# Altium schematic sheet Python_stm32f4_V1.0.0.SchDoc
size A3
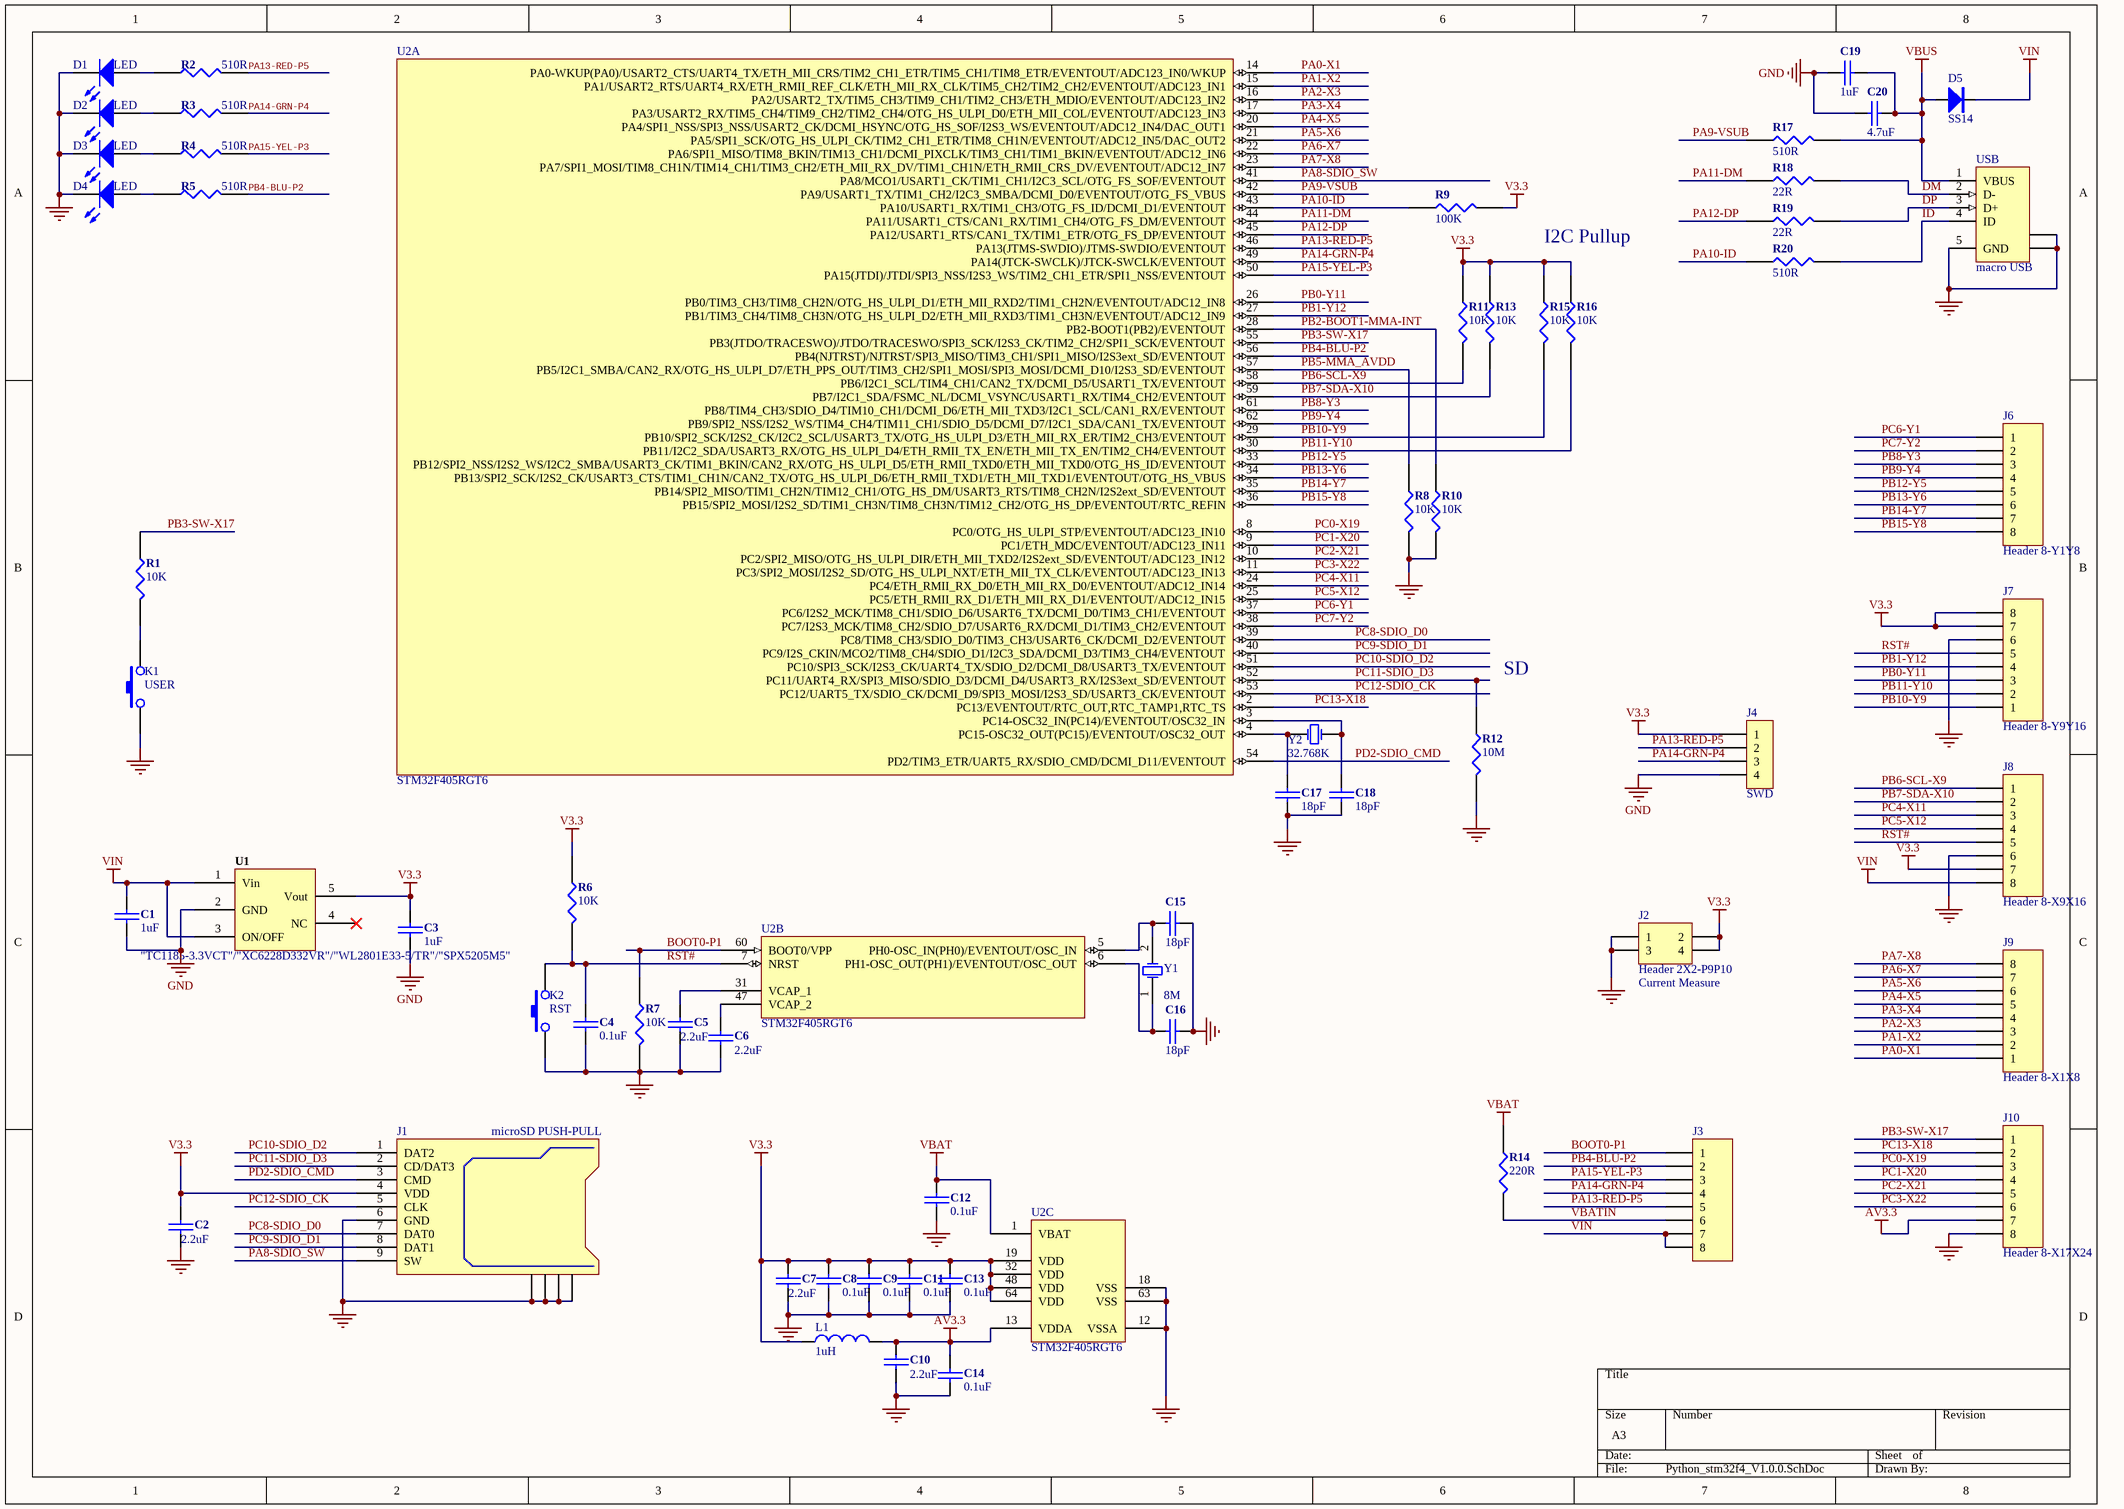
[diagram p0: Python_stm32f4_V1.0.0.SchDoc]

## Parts
C1  1uF  [C0402]
C2  2.2uF  [C0402]
C3  1uF  [C0402]
C4  0.1uF  [C0402]
C5  2.2uF  [C0402]
C6  2.2uF  [C0402]
C7  2.2uF  [C0402]
C8  0.1uF  [C0402]
C9  0.1uF  [C0402]
C10  2.2uF  [C0402]
C11  0.1uF  [C0402]
C12  0.1uF  [C0402]
C13  0.1uF  [C0402]
C14  0.1uF  [C0402]
C15  18pF  [C0402]
C16  18pF  [C0402]
C17  18pF  [C0402]
C18  18pF  [C0402]
C19  1uF  [C0402]
C20  4.7uF  [C0402]
D1  LED  [LED0603-green]
D2  LED  [LED0603-green]
D3  LED  [LED0603-green]
D4  LED  [LED0603-green]
D5  SS14  [Diode-0603]
J1  microSD PUSH-PULL  [MICROSD-1]
J2  Header 2X2-P9P10  [HDR2X2]
J3  (no value)  [HEADER-8]
J4  SWD  [HEADER-4]
J6  Header 8-Y1Y8  [HEADER-8]
J7  Header 8-Y9Y16  [HEADER-8]
J8  Header 8-X9X16  [HEADER-8]
J9  Header 8-X1X8  [HEADER-8]
J10  Header 8-X17X24  [HEADER-8]
K1  USER  [SW-4PIN-DIP]
K2  RST  [SW-4PIN-DIP]
L1  value 1uH  [C0402]  (hidden comment: Inductor)
R1  10K  [R0402 -1]
R2  510R  [R0402 -1]
R3  510R  [R0402 -1]
R4  510R  [R0402 -1]
R5  510R  [R0402 -1]
R6  10K  [R0402 -1]
R7  10K  [R0402 -1]
R8  10K  [R0402 -1]
R9  100K  [R0402 -1]
R10  10K  [R0402 -1]
R11  10K  [R0402 -1]
R12  10M  [R0402 -1]
R13  10K  [R0402 -1]
R14  220R  [R0402 -1]
R15  10K  [R0402 -1]
R16  10K  [R0402 -1]
R17  510R  [R0402 -1]
R18  22R  [R0402 -1]
R19  22R  [R0402 -1]
R20  510R  [R0402 -1]
U1  "TC1185-3.3VCT"/"XC6228D332VR"/"WL2801E33-5/TR"/"SPX5205M5"  [SOT-23-5]
U2  STM32F405RGT6  [LQFP-64]  (parts A,B,C of 3)
USB  macro USB  [MICRO_USB_9]
Y1  XTAL  [XTAL]  (value not drawn)
Y2  32.768K  [HDR1X2]

## Nets
AV3.3: C10.1 C14.2 J10.7 L1.2 U2.13(VDDA)
GND: C1.1 C2.2 C3.1 C4.1 C5.2 C6.2 C7.2 C8.1 C9.1 C10.2 C11.1 C12.1 C13.1 C14.1 C15.1 C16.1 C17.2 C18.2 C19.2 C20.2 D1.2(K) D2.2(K) D3.2(K) D4.2(K) J1.6(GND) J1.GP1 J1.GP2 J1.GP3 J1.GP4 J2.1 J2.3 J4.4 J7.6 J8.6 J10.8 K1.1 K2.1 R7.2 R8.2 R10.2 R12.2 U1.2(GND) U2.12(VSSA) U2.18(VSS) U2.63(VSS) USB.5(GND) USB.6(SHLD) USB.7(SHLD)
V3.3: C2.1 C3.2 C7.1 C8.2 C9.2 C11.2 C13.2 J1.4(VDD) J2.2 J2.4 J4.1 J7.7 J7.8 J8.7 L1.1 R6.1 R9.2 R11.1 R13.1 R15.1 R16.1 U1.5(Vout) U2.19(VDD) U2.32(VDD) U2.48(VDD) U2.64(VDD)
VBAT: C12.2 R14.1 U2.1(VBAT)
VBUS: C19.1 C20.1 D5.1 R17.2 USB.1(VBUS)
VIN: C1.2 D5.2 J3.7 J3.8 J8.8 U1.1(Vin) U1.3(ON/OFF)
BOOT0-P1: J3.1 R7.1 U2.60(BOOT0/VPP)
DM: R18.2 USB.2(D-)
DP: R19.2 USB.3(D+)
ID: R20.2 USB.4(ID)
PA0-X1: J9.1 U2.14(PA0-WKUP(PA0)/USART2_CTS/UART4_TX/ETH_MII_CRS/TIM2_CH1_ETR/TIM5_CH1/TIM8_ETR/EVENTOUT/ADC123_IN0/WKUP)
PA1-X2: J9.2 U2.15(PA1/USART2_RTS/UART4_RX/ETH_RMII_REF_CLK/ETH_MII_RX_CLK/TIM5_CH2/TIM2_CH2/EVENTOUT/ADC123_IN1)
PA2-X3: J9.3 U2.16(PA2/USART2_TX/TIM5_CH3/TIM9_CH1/TIM2_CH3/ETH_MDIO/EVENTOUT/ADC123_IN2)
PA3-X4: J9.4 U2.17(PA3/USART2_RX/TIM5_CH4/TIM9_CH2/TIM2_CH4/OTG_HS_ULPI_D0/ETH_MII_COL/EVENTOUT/ADC123_IN3)
PA4-X5: J9.5 U2.20(PA4/SPI1_NSS/SPI3_NSS/USART2_CK/DCMI_HSYNC/OTG_HS_SOF/I2S3_WS/EVENTOUT/ADC12_IN4/DAC_OUT1)
PA5-X6: J9.6 U2.21(PA5/SPI1_SCK/OTG_HS_ULPI_CK/TIM2_CH1_ETR/TIM8_CH1N/EVENTOUT/ADC12_IN5/DAC_OUT2)
PA6-X7: J9.7 U2.22(PA6/SPI1_MISO/TIM8_BKIN/TIM13_CH1/DCMI_PIXCLK/TIM3_CH1/TIM1_BKIN/EVENTOUT/ADC12_IN6)
PA7-X8: J9.8 U2.23(PA7/SPI1_MOSI/TIM8_CH1N/TIM14_CH1/TIM3_CH2/ETH_MII_RX_DV/TIM1_CH1N/ETH_RMII_CRS_DV/EVENTOUT/ADC12_IN7)
PA8-SDIO_SW: J1.9(SW) U2.41(PA8/MCO1/USART1_CK/TIM1_CH1/I2C3_SCL/OTG_FS_SOF/EVENTOUT)
PA9-VSUB: R17.1 U2.42(PA9/USART1_TX/TIM1_CH2/I2C3_SMBA/DCMI_D0/EVENTOUT/OTG_FS_VBUS)
PA10-ID: R9.1 R20.1 U2.43(PA10/USART1_RX/TIM1_CH3/OTG_FS_ID/DCMI_D1/EVENTOUT)
PA11-DM: R18.1 U2.44(PA11/USART1_CTS/CAN1_RX/TIM1_CH4/OTG_FS_DM/EVENTOUT)
PA12-DP: R19.1 U2.45(PA12/USART1_RTS/CAN1_TX/TIM1_ETR/OTG_FS_DP/EVENTOUT)
PA13-RED-P5: J3.5 J4.2 R2.2 U2.46(PA13(JTMS-SWDIO)/JTMS-SWDIO/EVENTOUT)
PA14-GRN-P4: J3.4 J4.3 R3.2 U2.49(PA14(JTCK-SWCLK)/JTCK-SWCLK/EVENTOUT)
PA15-YEL-P3: J3.3 R4.2 U2.50(PA15(JTDI)/JTDI/SPI3_NSS/I2S3_WS/TIM2_CH1_ETR/SPI1_NSS/EVENTOUT)
PB0-Y11: J7.3 U2.26(PB0/TIM3_CH3/TIM8_CH2N/OTG_HS_ULPI_D1/ETH_MII_RXD2/TIM1_CH2N/EVENTOUT/ADC12_IN8)
PB1-Y12: J7.4 U2.27(PB1/TIM3_CH4/TIM8_CH3N/OTG_HS_ULPI_D2/ETH_MII_RXD3/TIM1_CH3N/EVENTOUT/ADC12_IN9)
PB2-BOOT1-MMA-INT: R10.1 U2.28(PB2-BOOT1(PB2)/EVENTOUT)
PB3-SW-X17: J10.1 R1.1 U2.55(PB3(JTDO/TRACESWO)/JTDO/TRACESWO/SPI3_SCK/I2S3_CK/TIM2_CH2/SPI1_SCK/EVENTOUT)
PB4-BLU-P2: J3.2 R5.2 U2.56(PB4(NJTRST)/NJTRST/SPI3_MISO/TIM3_CH1/SPI1_MISO/I2S3ext_SD/EVENTOUT)
PB5-MMA_AVDD: R8.1 U2.57(PB5/I2C1_SMBA/CAN2_RX/OTG_HS_ULPI_D7/ETH_PPS_OUT/TIM3_CH2/SPI1_MOSI/SPI3_MOSI/DCMI_D10/I2S3_SD/EVENTOUT)
PB6-SCL-X9: J8.1 R11.2 U2.58(PB6/I2C1_SCL/TIM4_CH1/CAN2_TX/DCMI_D5/USART1_TX/EVENTOUT)
PB7-SDA-X10: J8.2 R13.2 U2.59(PB7/I2C1_SDA/FSMC_NL/DCMI_VSYNC/USART1_RX/TIM4_CH2/EVENTOUT)
PB8-Y3: J6.3 U2.61(PB8/TIM4_CH3/SDIO_D4/TIM10_CH1/DCMI_D6/ETH_MII_TXD3/I2C1_SCL/CAN1_RX/EVENTOUT)
PB9-Y4: J6.4 U2.62(PB9/SPI2_NSS/I2S2_WS/TIM4_CH4/TIM11_CH1/SDIO_D5/DCMI_D7/I2C1_SDA/CAN1_TX/EVENTOUT)
PB10-Y9: J7.1 R15.2 U2.29(PB10/SPI2_SCK/I2S2_CK/I2C2_SCL/USART3_TX/OTG_HS_ULPI_D3/ETH_MII_RX_ER/TIM2_CH3/EVENTOUT)
PB11-Y10: J7.2 R16.2 U2.30(PB11/I2C2_SDA/USART3_RX/OTG_HS_ULPI_D4/ETH_RMII_TX_EN/ETH_MII_TX_EN/TIM2_CH4/EVENTOUT)
PB12-Y5: J6.5 U2.33(PB12/SPI2_NSS/I2S2_WS/I2C2_SMBA/USART3_CK/TIM1_BKIN/CAN2_RX/OTG_HS_ULPI_D5/ETH_RMII_TXD0/ETH_MII_TXD0/OTG_HS_ID/EVENTOUT)
PB13-Y6: J6.6 U2.34(PB13/SPI2_SCK/I2S2_CK/USART3_CTS/TIM1_CH1N/CAN2_TX/OTG_HS_ULPI_D6/ETH_RMII_TXD1/ETH_MII_TXD1/EVENTOUT/OTG_HS_VBUS)
PB14-Y7: J6.7 U2.35(PB14/SPI2_MISO/TIM1_CH2N/TIM12_CH1/OTG_HS_DM/USART3_RTS/TIM8_CH2N/I2S2ext_SD/EVENTOUT)
PB15-Y8: J6.8 U2.36(PB15/SPI2_MOSI/I2S2_SD/TIM1_CH3N/TIM8_CH3N/TIM12_CH2/OTG_HS_DP/EVENTOUT/RTC_REFIN)
PC0-X19: J10.3 U2.8(PC0/OTG_HS_ULPI_STP/EVENTOUT/ADC123_IN10)
PC1-X20: J10.4 U2.9(PC1/ETH_MDC/EVENTOUT/ADC123_IN11)
PC2-X21: J10.5 U2.10(PC2/SPI2_MISO/OTG_HS_ULPI_DIR/ETH_MII_TXD2/I2S2ext_SD/EVENTOUT/ADC123_IN12)
PC3-X22: J10.6 U2.11(PC3/SPI2_MOSI/I2S2_SD/OTG_HS_ULPI_NXT/ETH_MII_TX_CLK/EVENTOUT/ADC123_IN13)
PC4-X11: J8.3 U2.24(PC4/ETH_RMII_RX_D0/ETH_MII_RX_D0/EVENTOUT/ADC12_IN14)
PC5-X12: J8.4 U2.25(PC5/ETH_RMII_RX_D1/ETH_MII_RX_D1/EVENTOUT/ADC12_IN15)
PC6-Y1: J6.1 U2.37(PC6/I2S2_MCK/TIM8_CH1/SDIO_D6/USART6_TX/DCMI_D0/TIM3_CH1/EVENTOUT)
PC7-Y2: J6.2 U2.38(PC7/I2S3_MCK/TIM8_CH2/SDIO_D7/USART6_RX/DCMI_D1/TIM3_CH2/EVENTOUT)
PC8-SDIO_D0: J1.7(DAT0) U2.39(PC8/TIM8_CH3/SDIO_D0/TIM3_CH3/USART6_CK/DCMI_D2/EVENTOUT)
PC9-SDIO_D1: J1.8(DAT1) U2.40(PC9/I2S_CKIN/MCO2/TIM8_CH4/SDIO_D1/I2C3_SDA/DCMI_D3/TIM3_CH4/EVENTOUT)
PC10-SDIO_D2: J1.1(DAT2) U2.51(PC10/SPI3_SCK/I2S3_CK/UART4_TX/SDIO_D2/DCMI_D8/USART3_TX/EVENTOUT)
PC11-SDIO_D3: J1.2(CD/DAT3) R12.1 U2.52(PC11/UART4_RX/SPI3_MISO/SDIO_D3/DCMI_D4/USART3_RX/I2S3ext_SD/EVENTOUT)
PC12-SDIO_CK: J1.5(CLK) U2.53(PC12/UART5_TX/SDIO_CK/DCMI_D9/SPI3_MOSI/I2S3_SD/USART3_CK/EVENTOUT)
PC13-X18: J10.2 U2.2(PC13/EVENTOUT/RTC_OUT,RTC_TAMP1,RTC_TS)
PD2-SDIO_CMD: J1.3(CMD) U2.54(PD2/TIM3_ETR/UART5_RX/SDIO_CMD/DCMI_D11/EVENTOUT)
RST#: C4.2 J7.5 J8.5 K2.2 R6.2 U2.7(NRST)
VBATIN: J3.6 R14.2
NetC5_1: C5.1 U2.31(VCAP_1)
NetC6_1: C6.1 U2.47(VCAP_2)
NetC15_2: C15.2 U2.5(PH0-OSC_IN(PH0)/EVENTOUT/OSC_IN) Y1.2(OSC2)
NetC16_2: C16.2 U2.6(PH1-OSC_OUT(PH1)/EVENTOUT/OSC_OUT) Y1.1(OSC1)
NetC17_1: C17.1 U2.4(PC15-OSC32_OUT(PC15)/EVENTOUT/OSC32_OUT) Y2.1(OSC1)
NetC18_1: C18.1 U2.3(PC14-OSC32_IN(PC14)/EVENTOUT/OSC32_IN) Y2.2(OSC2)
NetD1_1: D1.1(A) R2.1
NetD2_1: D2.1(A) R3.1
NetD3_1: D3.1(A) R4.1
NetD4_1: D4.1(A) R5.1
NetK1_2: K1.2 R1.2

Not connected (* = marked no-connect by the designer): U1 4(NC)*

## Notes on the sheet
- I2C Pullup
- SD
- (near J2) Current Measure
- (in symbol XTAL) 8M

## Library data of the parts
C1 C3 C4 C8 C9 C11-C14 C19 = 电容: Precision: 6.3V耐压; LIB: SMT电容
C2 C5-C7 C10 C15-C18 = CAP: SMT电容; Precision: 6.3V耐压; LIB: SMT电容
C20 = CAP: SMT电容; Precision: 16V耐压; LIB: SMT电容
D1-D4 = LED0: Typical INFRARED GaAs LED; Published: 8-Jun-2000; LatestRevisionDate: 08-Jul-2005; LatestRevisionNote: Mech Layer 1 removed.; PackageReference: LED-0; Publisher: Altium Limited; PackageDescription: LED; 2 Leads
D5 = Diode
J2 = Header 2X2: Header, 2-Pin, Dual row; LatestRevisionDate: 17-Jul-2002; LatestRevisionNote: Re-released for DXP Platform.; Publisher: Altium Limited
J3 J6-J10 = Header 8: Header, 8-Pin; LatestRevisionDate: 17-Jul-2002; LatestRevisionNote: Re-released for DXP Platform.; Publisher: Altium Limited
J4 = CON4: Connector
K1 K2 = SW-PB-1: 轻触按键
L1 = Inductor: Code_IEC: 1005; Published: 8-Jun-2000; LatestRevisionDate: 17-Jul-2002; LatestRevisionNote: Re-released for DXP Platform.; PackageReference: 0402-A; Publisher: Altium Limited; Code_JEITA: 0402
R1-R20 = RES1: SMT电阻; Precision: 5% 精度; LIB: SMT 电阻
U1 = S1132: LDO
USB = macro USB: USB 2.0, Right Angle, SMT, B Type, Receptacle, 5 Position, Black; ContactMaterial: Copper Alloy; ContactPlating: Gold (30); PCB_Layout: Complies with manufacturer's recommendation.; DrillSize: Corresponds to nominal value.; PanelGround: Without; Published: 15-Jul-2004; DatasheetDocument: 27-Jun-2003; PackageDocument: 27-Jun-2003; PackageReference: 440247; Publisher: Altium Limited; HousingMaterial: Thermoplastic; ComponentLink1Description: Manufacturer Link; ComponentLink1URL: http://www.tycoelectronics.com/; ComponentLink2Description: Packaging Specification; ComponentLink2URL: http://ecommas.tycoelectronics.com/commerce/DocumentDelivery/DDEController?Action=showdoc&DocId=Customer+Drawing%7F440247%7FD%7Fpdf%7FEnglish%7FC_440247_D.pdf
Y1 = XTAL: Crystal Oscillator; Published: 8-Jun-2000; LatestRevisionDate: 17-Jul-2002; LatestRevisionNote: Re-released for DXP Platform.; Publisher: Altium Limited
Y2 = XTAL